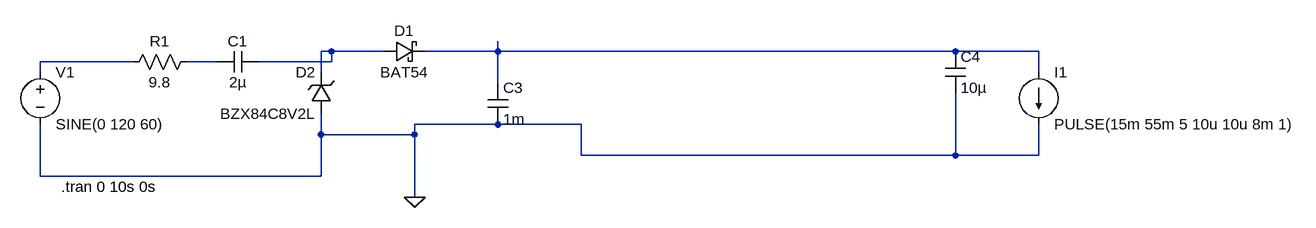
[diagram p0: schematic supply.asc]
supply.asc, the LTspice schematic file:
Version 4
SHEET 1 1680 680
WIRE 96 16 80 16
WIRE 176 16 96 16
WIRE 352 16 352 0
WIRE 352 16 240 16
WIRE 1056 16 352 16
WIRE 1184 16 1056 16
WIRE -208 32 -352 32
WIRE -80 32 -128 32
WIRE 96 32 96 16
WIRE 96 32 -16 32
WIRE -352 48 -352 32
WIRE 80 48 80 16
WIRE 1184 48 1184 16
WIRE 352 64 352 16
WIRE 352 128 224 128
WIRE 480 128 352 128
WIRE 80 144 80 112
WIRE 224 144 224 128
WIRE 224 144 80 144
WIRE 480 176 480 128
WIRE 1056 176 1056 80
WIRE 1056 176 480 176
WIRE 1184 176 1184 128
WIRE 1184 176 1056 176
WIRE -352 208 -352 128
WIRE 80 208 80 144
WIRE 80 208 -352 208
WIRE 224 240 224 144
FLAG 224 240 0
SYMBOL res -112 16 R90
WINDOW 0 0 56 VBottom 2
WINDOW 3 32 56 VTop 2
SYMATTR InstName R1
SYMATTR Value 9.8
SYMBOL cap 336 64 R0
SYMATTR InstName C3
SYMATTR Value 1m
SYMBOL voltage -352 32 R0
WINDOW 123 0 0 Left 2
WINDOW 39 0 0 Left 2
SYMATTR InstName V1
SYMATTR Value SINE(0 120 60)
SYMBOL zener 96 112 R180
WINDOW 0 24 64 Left 2
WINDOW 3 24 0 Left 2
SYMATTR InstName D2
SYMATTR Value BZX84C8V2L
SYMATTR Description Diode
SYMATTR Type diode
SYMBOL cap 1040 16 R0
SYMATTR InstName C4
SYMATTR Value 10µ
SYMBOL current 1184 48 R0
WINDOW 123 0 0 Left 2
WINDOW 39 0 0 Left 2
SYMATTR InstName I1
SYMATTR Value PULSE(15m 55m 5 10u 10u 8m 1)
SYMBOL schottky 176 32 R270
WINDOW 0 32 32 VTop 2
WINDOW 3 0 32 VBottom 2
SYMATTR InstName D1
SYMATTR Value BAT54
SYMATTR Description Diode
SYMATTR Type diode
SYMBOL cap -16 16 R90
WINDOW 0 0 32 VBottom 2
WINDOW 3 32 32 VTop 2
SYMATTR InstName C1
SYMATTR Value 2µ
TEXT -320 224 Left 2 !.tran 0 10s 0s

The netlist it stands for:
* supply.asc
R1 N004 N003 9.8
C3 N002 0 1m
V1 N003 0 SINE(0 120 60)
D2 0 N001 BZX84C8V2L
C4 N002 0 10µ
I1 N002 0 PULSE(15m 55m 5 10u 10u 8m 1)
D1 N001 N002 BAT54
C1 N001 N004 2µ
.model D D
.lib standard.dio
.tran 0 10s 0s
.backanno
.end